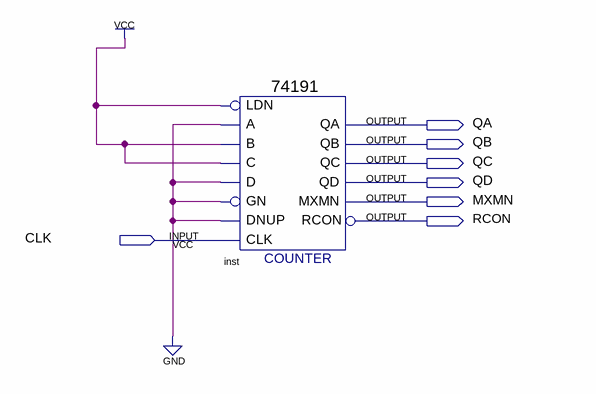
[diagram p0: schematic sheet]
// Quartus schematic contador-bin-sin.bdf as structural Verilog: 1 symbols, 7 pins
module \contador-bin-sin  (
  input  CLK,
  output QA,
  output QB,
  output QC,
  output QD,
  output MXMN,
  output RCON
);

  \74191  inst (
    .LDN(1'b1), .D(1'b0), .C(1'b1), .B(1'b1), .A(1'b0), .CLK(CLK), .DNUP(1'b0), .GN(1'b0), .RCON(RCON),
    .MXMN(MXMN), .QA(QA), .QB(QB), .QD(QD), .QC(QC));
endmodule
